# EAGLE design raster_prototyp1 (EAGLE 7.7.0)
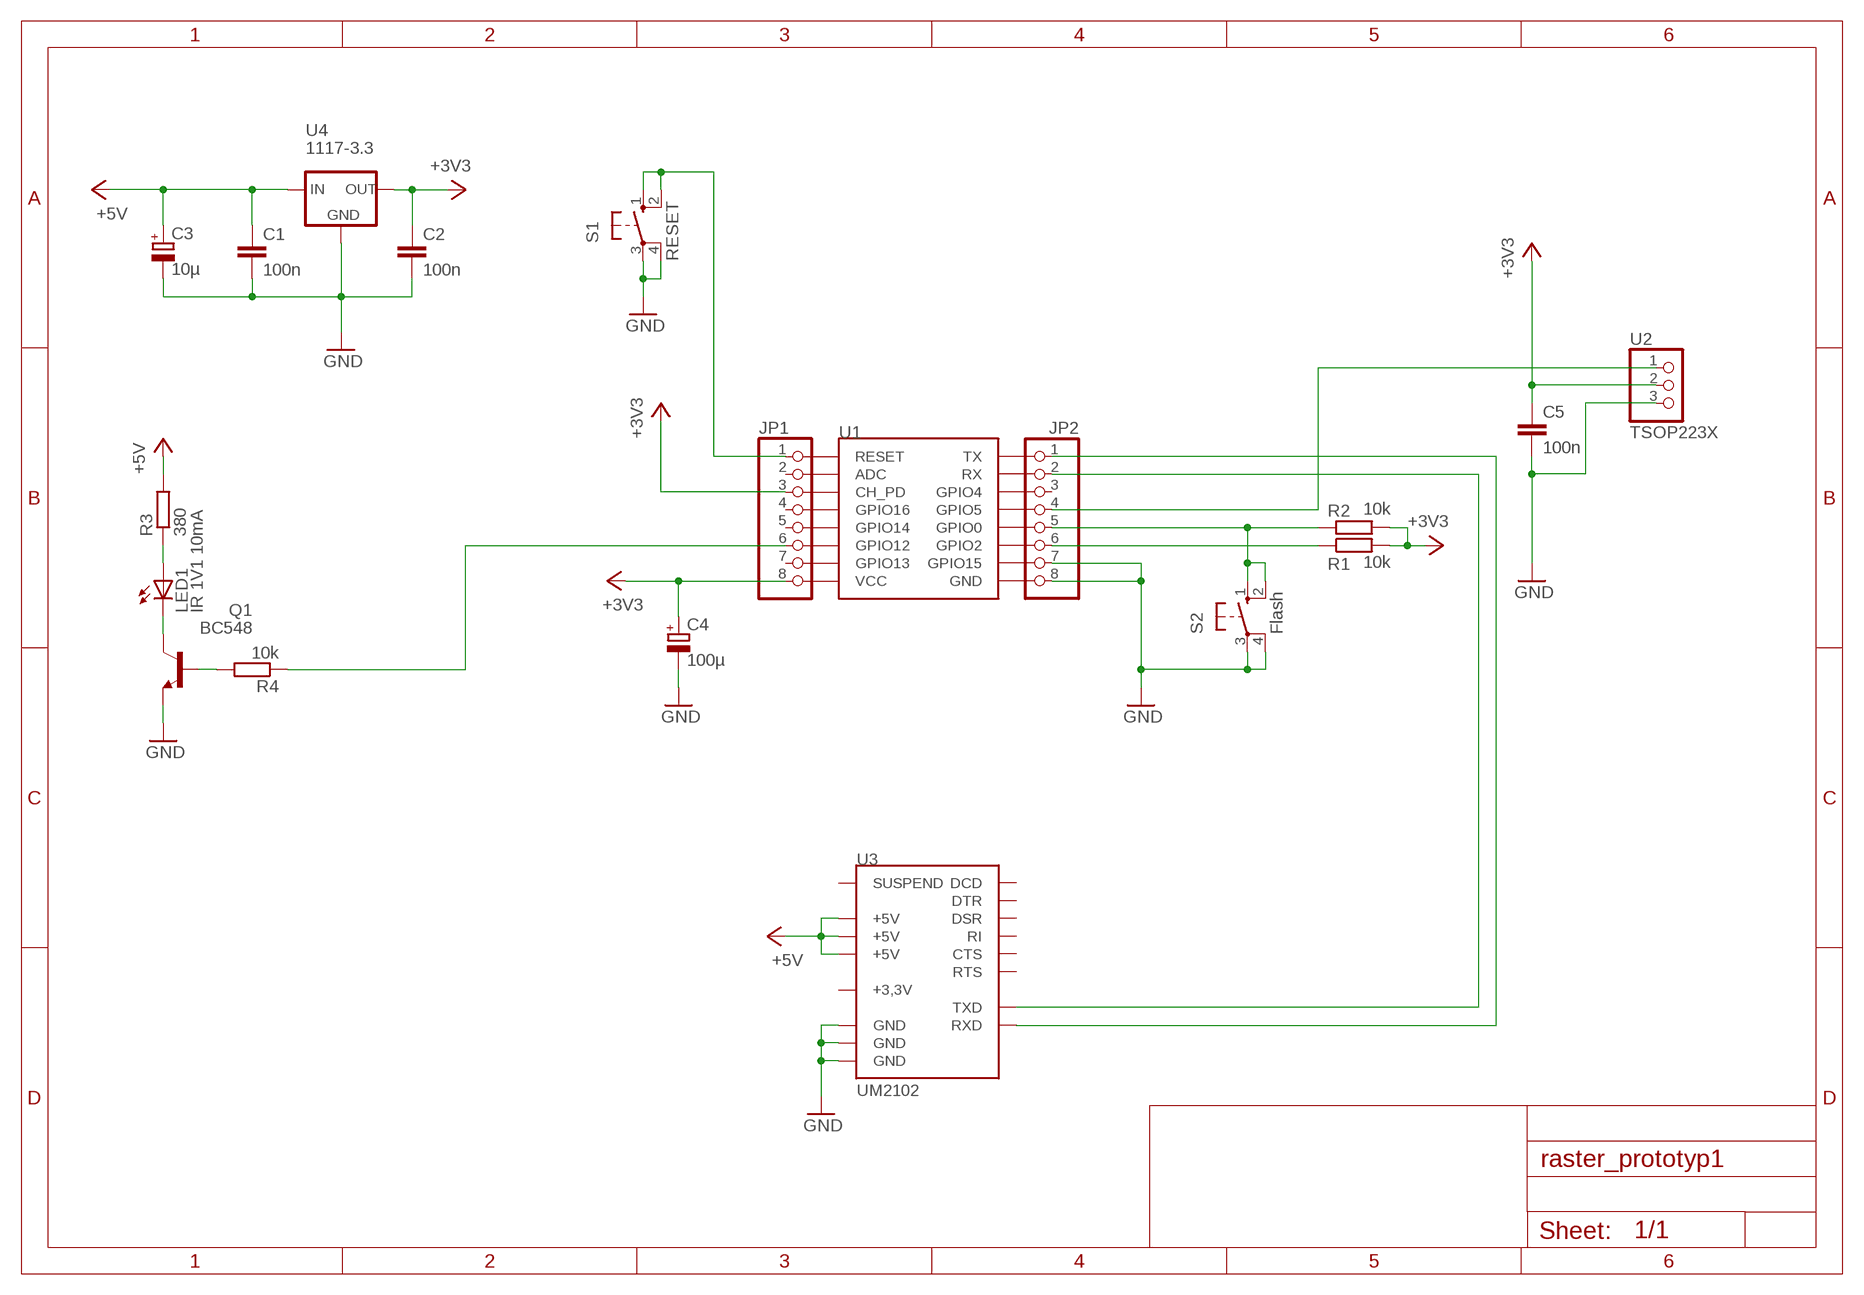
[diagram p0: schematic, sheet 1]

## Parts
C1  100n  C-EUC0805  [C0805]
C2  100n  C-EUC0805  [C0805]
C3  10µ  CPOL-EUE2.5-5  [E2,5-5]
C4  100µ  CPOL-EUE2.5-7  [E2,5-7]
C5  100n  C-EUC0805  [C0805]
JP1  PINHD-1X8_2.54  [1X08]
JP2  PINHD-1X8_2.54  [1X08]
LED1  IR 1V1 10mA  LED5MM  [LED5MM]
Q1  BC548  [TO92-EBC]
R1  10k  R-EU_0207/10  [0207/10]
R2  10k  R-EU_0207/10  [0207/10]
R3  380  R-EU_0207/15  [0207/15]
R4  10k  R-EU_0207/10  [0207/10]
S1  10-XX  [B3F-10XX]
S2  10-XX  [B3F-10XX]
U1  ESP12SMD  [ESP12-SMD]
U2  TSOP223X  PINHD-1X3_2.54  [1X03]
U3  UM2102  [UM2102]
U4  1117-3.3  LM1117  [SOT223]

## Nets
+3V3: C2.1 C4.+ C5.1 JP1.3 JP1.8 R1.2 R2.2 U2.2 U4.2(OUT)
+5V: C1.1 C3.+ R3.2 U3.ST1-3(+5V) U3.ST2-9(+5V) U3.ST3-7(+5V) U4.3(IN)
GND: C1.2 C2.2 C3.- C4.- C5.2 JP2.7 JP2.8 Q1.E S1.3(P) S1.4(P1) S2.3(P) S2.4(P1) U2.3 U3.ST1-1(GND) U3.ST2-7(GND) U3.ST3-9(GND) U4.1(GND)
N$1: JP2.4 U2.1
N$2: JP2.6 R1.1
N$4: LED1.A R3.1
N$5: JP1.1 S1.1(S) S1.2(S1)
N$6: LED1.K(C) Q1.C
N$7: JP2.5 R2.1 S2.1(S) S2.2(S1)
N$8: Q1.B R4.2
N$9: JP1.6 R4.1
N$10: JP2.1 U3.ST2-5(RXD)
N$11: JP2.2 U3.ST2-3(TXD)
Unconnected: JP1.2 JP1.4 JP1.5 JP1.7 JP2.3 U1.ADC U1.CH_PD U1.GND U1.GPIO0 U1.GPIO2 U1.GPIO4 U1.GPIO5 U1.GPIO12 U1.GPIO13 U1.GPIO14 U1.GPIO15 U1.GPIO16 U1.RESET U1.RXD0(RX) U1.TXD0(TX) U1.VCC U3.ST1-5(DSR) U3.ST1-7(DTR) U3.ST1-9(DCD) U3.ST2-1(RI) U3.ST3-1(SUSPEND) U3.ST3-3(CTS) U3.ST3-5(RTS)

## Notes on the sheet
- RESET
- Flash

## Power pins joined to a net without a drawn wire
+3,3V: U3.ST2-11(+3,3V)

## Library data of the parts
C1 C2 C5 = rcl:C-EU: CAPACITOR, European symbol
C3 C4 = rcl:CPOL-EU: POLARIZED CAPACITOR, European symbol
JP1 JP2 = pinhead:PINHD-1X8: PIN HEADER
LED1 = led:LED: LED OSRAM: - CHIPLED LG R971, LG N971, LY N971, LG Q971, LY Q971, LO R971, LY R971 LH N974, LH R974 LS Q976, LO Q976, LY Q976 LO Q996 - Hyper CHIPLED LW Q18S LB Q993, LB Q99A, LB R99A - SideLED LS A670, LO A670, LY A670, LG A670, LP A670 LB A673, LV A673, LT A673, LW A673 LH A674 LY A675 LS A676, LA A676, LO A676, LY A676, LW A676 LS A679, LY A679, LG A679 - Hyper Micro SIDELED® LS Y876, LA Y876, LO Y876, LY Y876 LT Y87S - SmartLED LW L88C, LW L88S LB L89C, LB L89S, LG L890 LS L89K, LO L89K, LY L89K LS L896, LA L896, LO L896, LY L896 - TOPLED LS T670, LO T670, LY T670, LG T670, LP T670 LSG T670, LSP T670, LSY T670, LOP T670, LYG T670 LG T671, LOG T671, LSG T671 LB T673, LV T673, LT T673, LW T673 LH T674 LS T676, LA T676, LO T676, LY T676, LB T676, LH T676, LSB T676, LW T676 LB T67C, LV T67C, LT T67C, LS T67K, LO T67K, LY T67K, LW E67C LS E67B, LA E67B, LO E67B, LY E67B, LB E67C, LV E67C, LT E67C LW T67C LS T679, LY T679, LG T679 LS T770, LO T770, LY T770, LG T770, LP T770 LB T773, LV T773, LT T773, LW T773 LH T774 LS E675, LA E675, LY E675, LS T675 LS T776, LA T776, LO T776, LY T776, LB T776 LHGB T686 LT T68C, LB T68C - Hyper Mini TOPLED® LB M676 - Mini TOPLED Santana® LG M470 LS M47K, LO M47K, LY M47K Source: http://www.osram.convergy.de LUXEON: - LUMILED® LXK2-PW12-R00, LXK2-PW12-S00, LXK2-PW14-U00, LXK2-PW14-V00 LXK2-PM12-R00, LXK2-PM12-S00, LXK2-PM14-U00 LXK2-PE12-Q00, LXK2-PE12-R00, LXK2-PE12-S00, LXK2-PE14-T00, LXK2-PE14-U00 LXK2-PB12-K00, LXK2-PB12-L00, LXK2-PB12-M00, LXK2-PB14-N00, LXK2-PB14-P00, LXK2-PB14-Q00 LXK2-PR12-L00, LXK2-PR12-M00, LXK2-PR14-Q00, LXK2-PR14-R00 LXK2-PD12-Q00, LXK2-PD12-R00, LXK2-PD12-S00 LXK2-PH12-R00, LXK2-PH12-S00 LXK2-PL12-P00, LXK2-PL12-Q00, LXK2-PL12-R00 Source: www.luxeon.com KINGBRIGHT: KA-3528ASYC Source: www.kingbright.com
Q1 = transistor-npn:BC548*: NPN Transistor
R1-R4 = rcl:R-EU_: RESISTOR, European symbol
S1 S2 = switch-omron:10-XX: OMRON SWITCH; MPN: B3F-1000; OC_FARNELL: 176432; OC_NEWARK: 36M3542
U1 = espressif:ESP12: ESP8266 Wifi module 12
U2 = pinhead:PINHD-1X3: PIN HEADER
U3 = special:UM2102
U4 = v-reg-3:LM1117

## Board
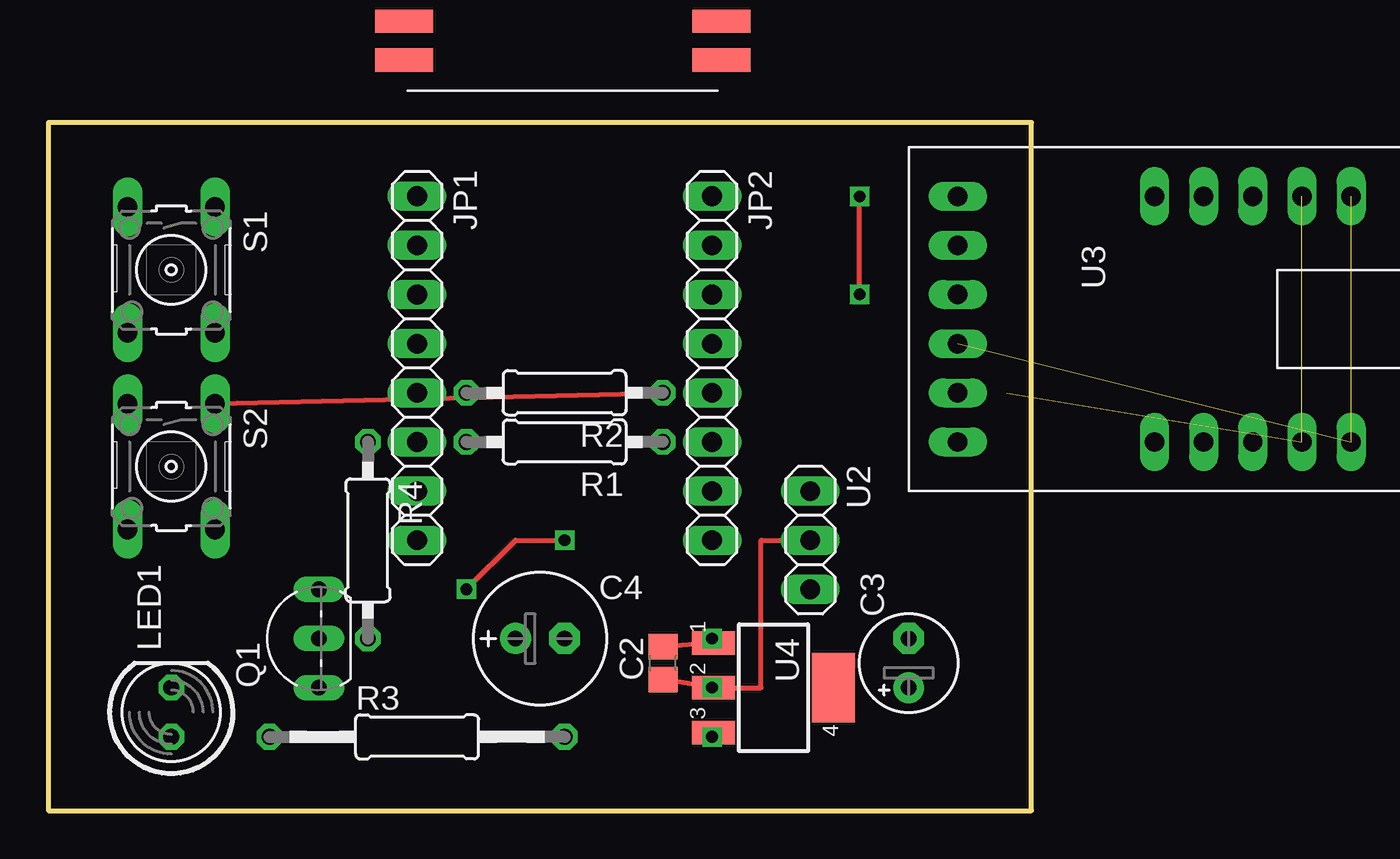
[diagram p1: board, top side]
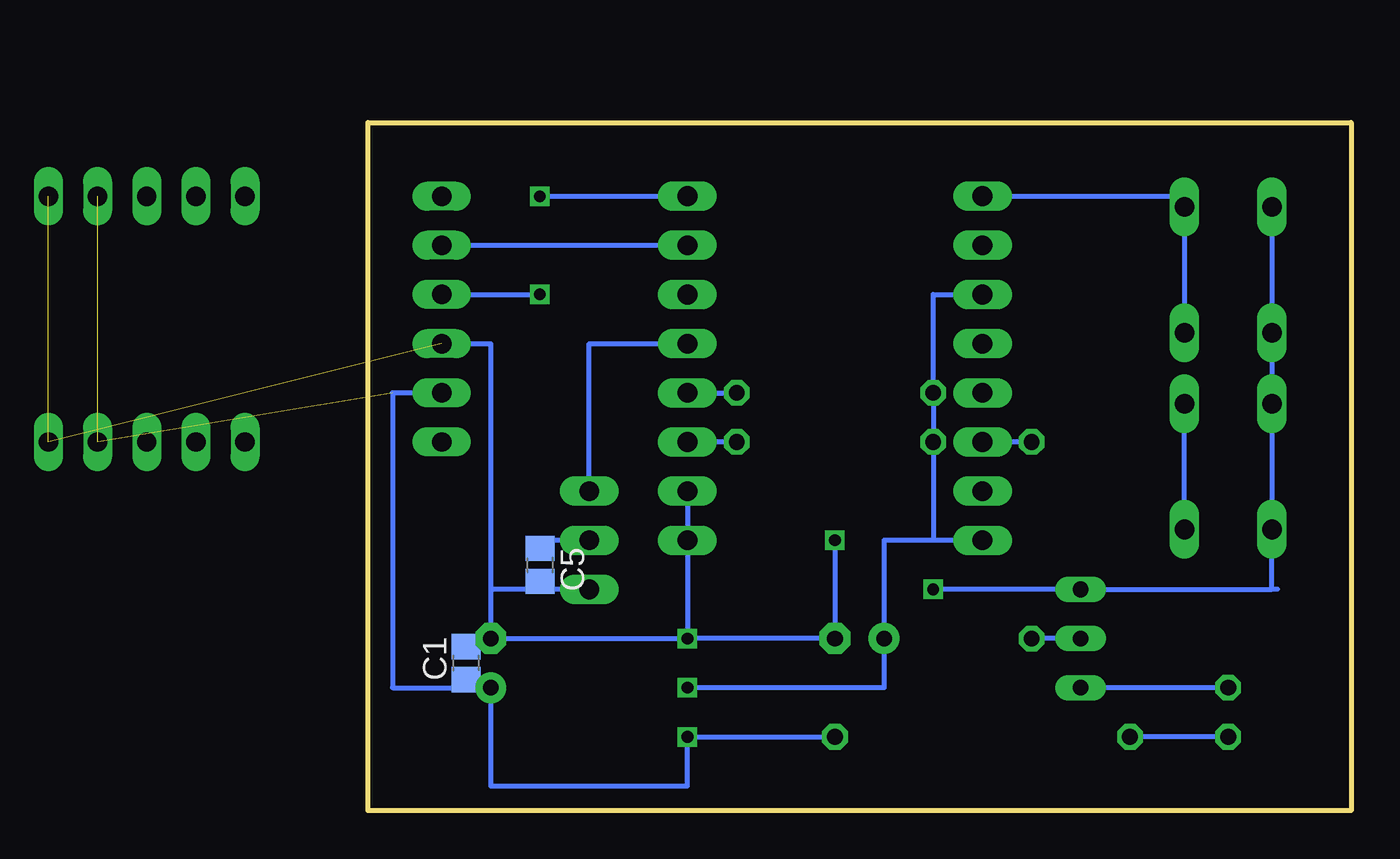
[diagram p2: board, bottom side, seen from below]

Size 50.8 x 35.56 mm. Coordinates in mm from the lower left corner, seen from the top.
Outline: 0,0 50.8,0 50.8,35.56 0,35.56 0,0
Copper layers (1*16): Top 0.035mm / dielectric 1.5mm / Bottom 0.035mm
Design rules "default": minimum track width 10mil, minimum drill 24mil, track to track 8mil, track to pad 8mil, pad to pad 8mil, via to via 8mil, smd to smd 8mil, copper to edge 40mil, drill to drill 8mil, minimum pad ring 10mil, minimum via ring 8mil, stop-mask expansion 4mil, vias tented up to drill 0mil, thermal gap 10mil

### Footprints (pad centres in the part's own frame; a part is rotated, then mirrored left to right if it is on the bottom)
C0805 = smd 1.3 x 1.5: 1 -0.85,0; 2 0.85,0
E2,5-5 = drill 0.813 pad 1.6: + -1.27,0 | drill 0.813 pad 1.6 octagon: - 1.27,0
E2,5-7 = drill 0.813 pad 1.6: + -1.27,0 | drill 0.813 pad 1.6 octagon: - 1.27,0
1X08 = drill 1.016 long: 1 -8.89,0; 2 -6.35,0; 3 -3.81,0; 4 -1.27,0; 5 1.27,0; 6 3.81,0; 7 6.35,0; 8 8.89,0
LED5MM = drill 0.813 octagon: A -1.27,0; K 1.27,0
TO92-EBC = drill 0.813 long: B 0,-1.27; C -2.54,-1.27; E 2.54,-1.27
0207/10 = drill 0.813 octagon: 1 -5.08,0; 2 5.08,0
0207/15 = drill 0.813 octagon: 1 -7.62,0; 2 7.62,0
B3F-10XX = drill 1.016 long: 1 -3.251,2.261; 2 3.251,2.261; 3 -3.251,-2.261; 4 3.251,-2.261
ESP12-SMD = smd 3 x 1.2: ADC -8.3,3.8; CH_PD -8.3,1.8; GND 8.1,-8.2; GPIO0 8.1,-2.2; GPIO2 8.1,-4.2; GPIO4 8.1,1.8; GPIO5 8.1,-0.2; GPIO12 -8.3,-4.2; GPIO13 -8.3,-6.2; GPIO14 -8.3,-2.2; GPIO15 8.1,-6.2; GPIO16 -8.3,-0.2; RESET -8.3,5.8; RXD0 8.1,3.8; TXD0 8.1,5.8; VCC -8.3,-8.2
1X03 = drill 1.016 long: 1 -2.54,0; 2 0,0; 3 2.54,0
UM2102 = drill 1 long: ST1-1 -6.35,10.16; ST1-3 -6.35,7.62; ST1-5 -6.35,5.08; ST1-7 -6.35,2.54; ST1-9 -6.35,0; ST2-1 -6.35,-10.16; ST2-3 -3.81,-10.16; ST2-5 -1.27,-10.16; ST2-7 1.27,-10.16; ST2-9 3.81,-10.16; ST2-11 6.35,-10.16; ST3-1 6.35,0; ST3-3 6.35,2.54; ST3-5 6.35,5.08; ST3-7 6.35,7.62; ST3-9 6.35,10.16
SOT223 = smd 1.219 x 2.235: 1 -2.311,-3.099; 2 0,-3.099; 3 2.311,-3.099 | smd 3.6 x 2.2: 4 0,3.099

### Placement (x,y rotation side)
C1  45.72,7.62 90 bottom
C2  31.75,7.62 90 top
C3  44.45,7.62 90 top
C4  25.4,8.89 0 top
C5  41.91,12.7 270 bottom
JP1  19.05,22.86 270 top
JP2  34.29,22.86 270 top
LED1  6.35,5.08 90 top
Q1  12.7,8.89 90 top
R1  26.67,19.05 180 top
R2  26.67,21.59 180 top
R3  19.05,3.81 0 top
R4  16.51,13.97 270 top
S1  6.35,27.94 270 top
S2  6.35,17.78 270 top
U1  26.67,46.99 0 top  (outside the outline)
U2  39.37,13.97 270 top
U3  57.15,25.4 270 top
U4  37.47,6.35 270 top

### Tracks (layer width: path | path; a pad name or v marks a point on that pad's centre or on a via)
+3V3  (via drill 0.6)
  Top 0.254: U4.2 C2.1 | v34.29,6.35 U4.2 | U4.2 36.83,6.35 36.83,13.97 U2.2
  Bottom 0.254: v34.29,6.35 24.13,6.35 C4.+ 24.13,13.97 21.59,13.97 | JP1.8 21.59,13.97 | 21.59,13.97 R1.2 R2.2 21.59,26.67 JP1.3 | U2.2 41.49,13.97 C5.1
+5V  (via drill 0.6)  (2 unrouted)
  Top 0.254: U4.3 v34.29,3.81
  Bottom 0.254: U3.ST2-9 49.53,21.59 49.53,6.35 C3.+ | R3.2 v34.29,3.81 34.29,1.27 44.45,1.27 C3.+ | C1.1 44.45,6.77 C3.+
GND  (via drill 0.6)  (2 unrouted)
  Top 0.254: C2.2 U4.1 v34.29,8.89 | v21.59,11.43 24.13,13.97 v26.67,13.97
  Bottom 0.254: S1.3 S1.4 S2.3 S2.4 4.09,11.43 | v34.29,8.89 C4.- v26.67,13.97 | v34.29,8.89 JP2.8 JP2.7 | C3.- v34.29,8.89 | C1.2 44.45,8.47 C3.- | 4.09,11.43 Q1.E v21.59,11.43 | 3.81,11.43 4.09,11.43 | U3.ST2-7 44.45,24.13 44.45,11.43 | 44.45,11.43 C3.- | 44.45,11.43 U2.3 41.49,11.43 C5.2
N$1
  Bottom 0.254: U2.1 39.37,24.13 JP2.4
N$2
  Bottom 0.254: R1.1 JP2.6
N$4
  Bottom 0.254: LED1.A R3.1
N$5
  Bottom 0.254: JP1.1 8.61,31.75 S1.1 S1.2
N$6
  Bottom 0.254: LED1.K Q1.C
N$7
  Top 0.254: S2.1 R2.1
  Bottom 0.254: JP2.5 R2.1 | S2.2 S2.1
N$8
  Bottom 0.254: Q1.B R4.2
N$9
  Bottom 0.254: R4.1 JP1.6
N$10  (via drill 0.6)
  Top 0.254: v41.91,26.67 v41.91,31.75
  Bottom 0.254: U3.ST2-5 v41.91,26.67 | v41.91,31.75 JP2.1
N$11
  Bottom 0.254: U3.ST2-3 JP2.2